# EAGLE design Motor (EAGLE 6.5.0)
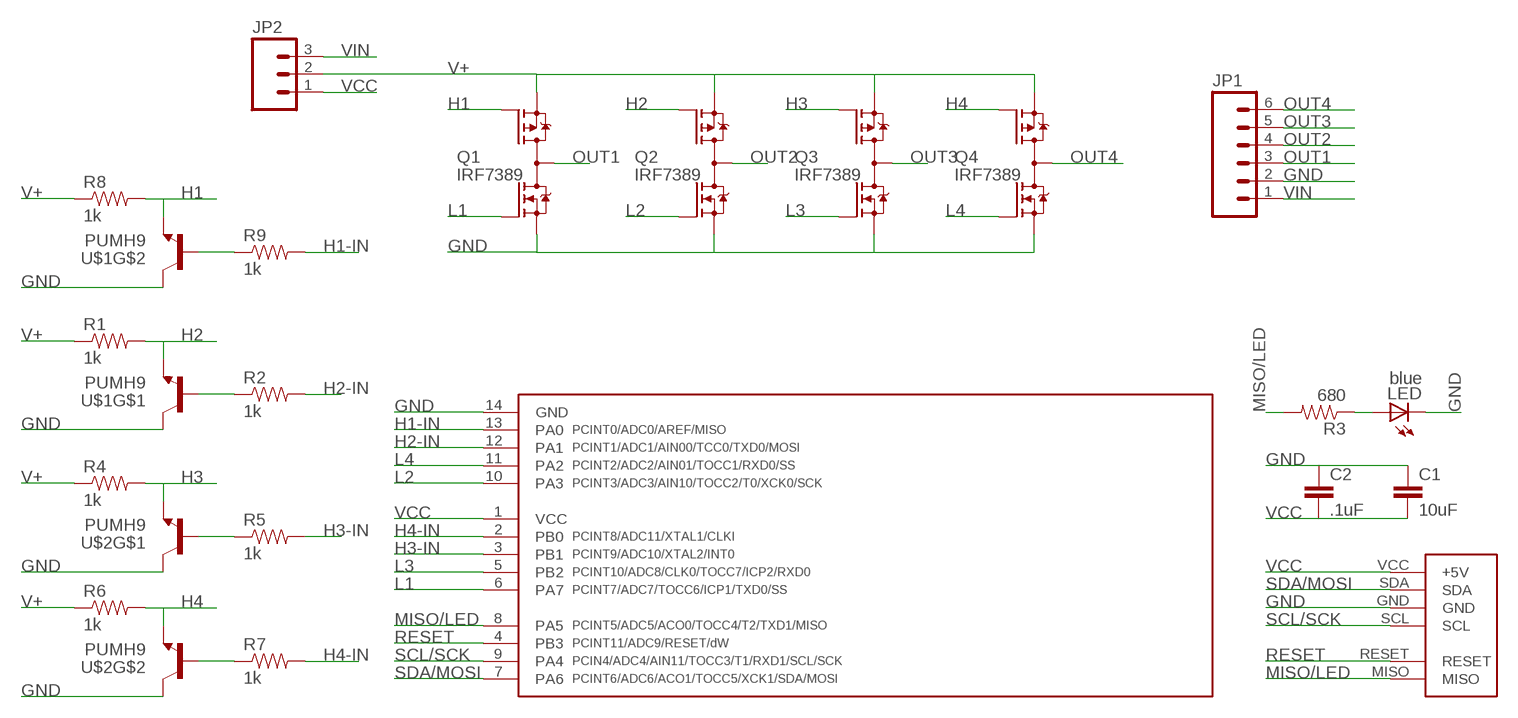
[diagram p0: schematic, sheet 1]

## Parts
C1  10uF  CAP0805  [0805]
C2  .1uF  CAP0805  [0805]
JP1  M063.5MM-6  [SCREWTERMINAL-3.5MM-6]
JP2  M03LOCK_NO_SILK  [1X03_LOCK_NO_SILK]
LED  blue  LEDCHIPLED_1206  [CHIPLED_1206]
Q1  IRF7389  [SO08-IRF]
Q2  IRF7389  [SO08-IRF]
Q3  IRF7389  [SO08-IRF]
Q4  IRF7389  [SO08-IRF]
R1  1k  RESISTOR0805-RES  [0805]
R2  1k  RESISTOR0805-RES  [0805]
R3  680  RESISTOR0805-RES  [0805]
R4  1k  RESISTOR0805-RES  [0805]
R5  1k  RESISTOR0805-RES  [0805]
R6  1k  RESISTOR0805-RES  [0805]
R7  1k  RESISTOR0805-RES  [0805]
R8  1k  RESISTOR0805-RES  [0805]
R9  1k  RESISTOR0805-RES  [0805]
U$1  PUMH9  MMDT3904  [SOT363]
U$2  PUMH9  MMDT3904  [SOT363]
U$3  TINY841  [SOIC14]
U$4  FOOTPRINTFOOTPRINT-2  [FOOTPRINT2]

## Nets
GND: C1.1 C2.1 JP1.2 LED.C Q1.1(N-S) Q2.1(N-S) Q3.1(N-S) Q4.1(N-S) U$1.3(C) U$1.6(C) U$2.3(C) U$2.6(C) U$3.14(GND) U$4.GND
H1: Q1.4(P-G) R8.2 U$1.1(E)
H1-IN: R9.2 U$3.13(PA0)
H2: Q2.4(P-G) R1.2 U$1.4(E)
H2-IN: R2.2 U$3.12(PA1)
H3: Q3.4(P-G) R4.2 U$2.4(E)
H3-IN: R5.2 U$3.3(PB1)
H4: Q4.4(P-G) R6.2 U$2.1(E)
H4-IN: R7.2 U$3.2(PB0)
L1: Q1.2(N-G) U$3.6(PA7)
L2: Q2.2(N-G) U$3.10(PA3)
L3: Q3.2(N-G) U$3.5(PB2)
L4: Q4.2(N-G) U$3.11(PA2)
MISO/LED: R3.2 U$3.8(PA5) U$4.MISO
N$2: R2.1 U$1.5(B)
N$4: R5.1 U$2.5(B)
N$5: LED.A R3.1
N$7: R7.1 U$2.2(B)
N$9: R9.1 U$1.2(B)
OUT1: JP1.3 Q1.5(D) Q1.6(D) Q1.7(D) Q1.8(D)
OUT2: JP1.4 Q2.5(D) Q2.6(D) Q2.7(D) Q2.8(D)
OUT3: JP1.5 Q3.5(D) Q3.6(D) Q3.7(D) Q3.8(D)
OUT4: JP1.6 Q4.5(D) Q4.6(D) Q4.7(D) Q4.8(D)
RESET: U$3.4(PB3) U$4.RESET
SCL/SCK: U$3.9(PA4) U$4.SCL
SDA/MOSI: U$3.7(PA6) U$4.SDA
V+: JP2.2 Q1.3(P-S) Q2.3(P-S) Q3.3(P-S) Q4.3(P-S) R1.1 R4.1 R6.1 R8.1
VCC: C1.2 C2.2 JP2.1 U$3.1(VCC) U$4.VCC(+5V)
VIN: JP1.1 JP2.3

## Library data of the parts
C1 C2 = SparkFun-Capacitors:CAP: Capacitor Standard 0603 ceramic capacitor, and 0.1" leaded capacitor.
JP1 = SparkFun-Connectors:M06: Header 6 Standard 6-pin 0.1" header. Use with straight break away headers (SKU : PRT-00116), right angle break away headers (PRT-00553), swiss pins (PRT-00743), machine pins (PRT-00117), and female headers (PRT-00115). Molex polarized connector foot print use with SKU : PRT-08094 with associated crimp pins and housings. NOTES ON THE VARIANTS LOCK and LOCK_LONGPADS... This footprint was designed to help hold the alignment of a through-hole component (i.e. 6-pin header) while soldering it into place. You may notice that each hole has been shifted either up or down by 0.005 of an inch from it's more standard position (which is a perfectly straight line). This slight alteration caused the pins (the squares in the middle) to touch the edges of the holes. Because they are alternating, it causes a "brace" to hold the component in place. 0.005 has proven to be the perfect amount of "off-center" position when using our standard breakaway headers. Although looks a little odd when you look at the bare footprint, once you have a header in there, the alteration is very hard to notice. Also,if you push a header all the way into place, it is covered up entirely on the bottom side. This idea of altering the position of holes to aid alignment will be further integrated into the Sparkfun Library for other footprints. It can help hold any component with 3 or more connection pins.
JP2 = SparkFun-Connectors:M03: Header 3 Standard 3-pin 0.1" header. Use with straight break away headers (SKU : PRT-00116), right angle break away headers (PRT-00553), swiss pins (PRT-00743), machine pins (PRT-00117), and female headers (PRT-00115). Molex polarized connector foot print use with SKU : PRT-08232 with associated crimp pins and housings.
LED = led:LED: LED OSRAM: - CHIPLED LG R971, LG N971, LY N971, LG Q971, LY Q971, LO R971, LY R971 LH N974, LH R974 LS Q976, LO Q976, LY Q976 LO Q996 - Hyper CHIPLED LW Q18S LB Q993, LB Q99A, LB R99A - SideLED LS A670, LO A670, LY A670, LG A670, LP A670 LB A673, LV A673, LT A673, LW A673 LH A674 LY A675 LS A676, LA A676, LO A676, LY A676, LW A676 LS A679, LY A679, LG A679 - Hyper Micro SIDELED® LS Y876, LA Y876, LO Y876, LY Y876 LT Y87S - SmartLED LW L88C, LW L88S LB L89C, LB L89S, LG L890 LS L89K, LO L89K, LY L89K LS L896, LA L896, LO L896, LY L896 - TOPLED LS T670, LO T670, LY T670, LG T670, LP T670 LSG T670, LSP T670, LSY T670, LOP T670, LYG T670 LG T671, LOG T671, LSG T671 LB T673, LV T673, LT T673, LW T673 LH T674 LS T676, LA T676, LO T676, LY T676, LB T676, LH T676, LSB T676, LW T676 LB T67C, LV T67C, LT T67C, LS T67K, LO T67K, LY T67K, LW E67C LS E67B, LA E67B, LO E67B, LY E67B, LB E67C, LV E67C, LT E67C LW T67C LS T679, LY T679, LG T679 LS T770, LO T770, LY T770, LG T770, LP T770 LB T773, LV T773, LT T773, LW T773 LH T774 LS E675, LA E675, LY E675, LS T675 LS T776, LA T776, LO T776, LY T776, LB T776 LHGB T686 LT T68C, LB T68C - Hyper Mini TOPLED® LB M676 - Mini TOPLED Santana® LG M470 LS M47K, LO M47K, LY M47K Source: http://www.osram.convergy.de LUXEON: - LUMILED® LXK2-PW12-R00, LXK2-PW12-S00, LXK2-PW14-U00, LXK2-PW14-V00 LXK2-PM12-R00, LXK2-PM12-S00, LXK2-PM14-U00 LXK2-PE12-Q00, LXK2-PE12-R00, LXK2-PE12-S00, LXK2-PE14-T00, LXK2-PE14-U00 LXK2-PB12-K00, LXK2-PB12-L00, LXK2-PB12-M00, LXK2-PB14-N00, LXK2-PB14-P00, LXK2-PB14-Q00 LXK2-PR12-L00, LXK2-PR12-M00, LXK2-PR14-Q00, LXK2-PR14-R00 LXK2-PD12-Q00, LXK2-PD12-R00, LXK2-PD12-S00 LXK2-PH12-R00, LXK2-PH12-S00 LXK2-PL12-P00, LXK2-PL12-Q00, LXK2-PL12-R00 Source: www.luxeon.com KINGBRIGHT: KA-3528ASYC Source: www.kingbright.com
Q1-Q4 = transistor-fet:IRF7389: Complimentary Half Bridge HEXFET Power MOSFET Source: http://www.irf.com/product-info/datasheets/data/irf7389.pdf
R1 R2 R4-R9 = SparkFun-Resistors:RESISTOR: Resistor Basic schematic elements and footprints for 0603, 1206, and PTH resistors.
R3 = SparkFun-Passives:RESISTOR: Resistor Basic schematic elements and footprints for 0603, 1206, and PTH resistors.
U$1 U$2 = SparkFun-DiscreteSemi:MMDT3904: Dual NPN transistor
U$3 = IntegerLabs:TINY841
U$4 = IntegerLabs:FOOTPRINT

## Board
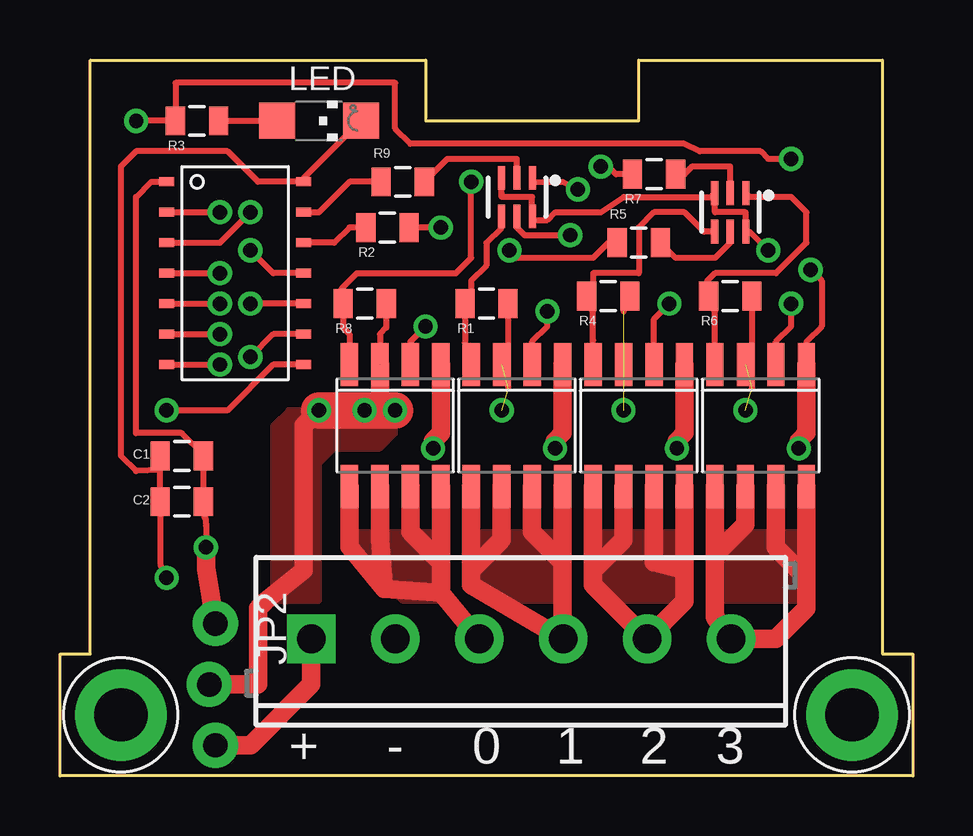
[diagram p1: board, top side]
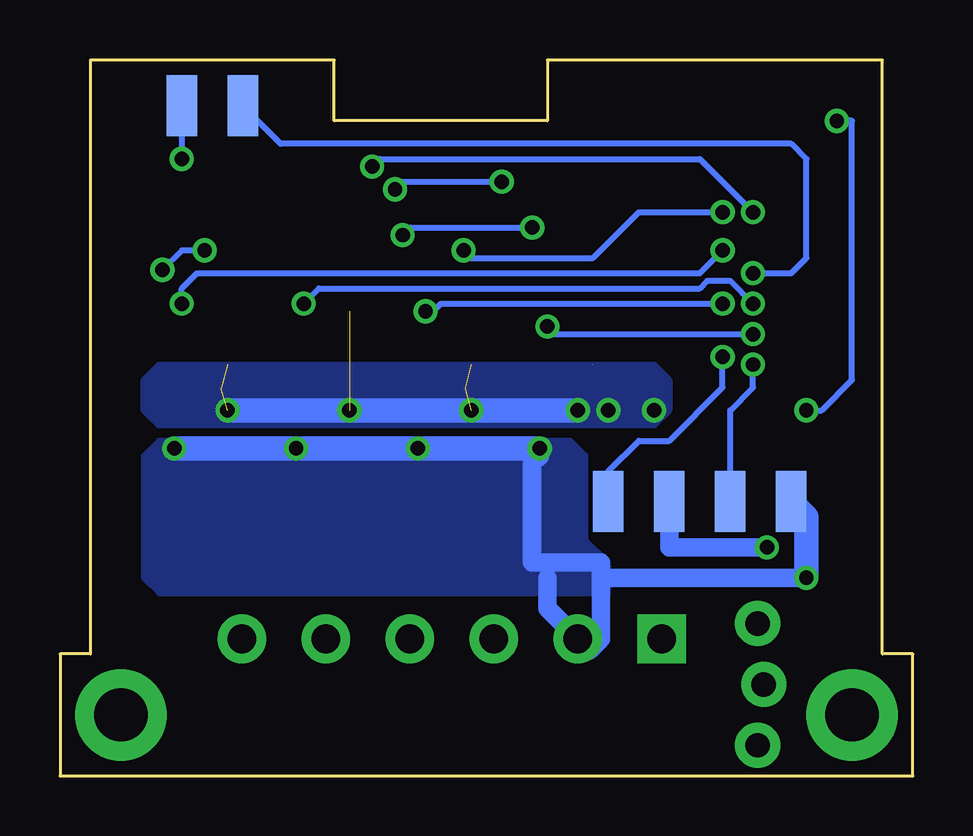
[diagram p2: board, bottom side, seen from below]

Size 35.56 x 29.84 mm. Coordinates in mm from the lower left corner, seen from the top.
Copper layers (1*16): Top 0.0178mm / dielectric 59mil / Bottom 0.0178mm
Design rules "SSC-EAGLE-2Lyr_v1.0.0.3": minimum track width 6mil, minimum drill 14mil, track to track 6mil, track to pad 6mil, pad to pad 6mil, via to via 6mil, smd to smd 6mil, copper to edge 20mil, drill to drill 16mil, minimum pad ring 8mil, minimum via ring 8mil, stop-mask expansion 3mil, vias tented up to drill 0mil, thermal gap 10mil

### Footprints (pad centres in the part's own frame; a part is rotated, then mirrored left to right if it is on the bottom)
0805 = smd 0.8 x 1.2: 1 -0.9,0; 2 0.9,0
SCREWTERMINAL-3.5MM-6 = drill 1.2 pad 2.032 square: 1 0,0 | drill 1.2 pad 2.032: 2 3.5,0; 3 7,0; 4 10.5,0; 5 14,0; 6 17.5,0
1X03_LOCK_NO_SILK = drill 1.016 pad 1.88: 1 0,0.127; 2 2.54,-0.127; 3 5.08,0.127
CHIPLED_1206 = smd 1.5 x 1.5: A 0,-1.75; C 0,1.75
SO08-IRF = smd 0.72 x 1.78: 1 -1.905,-2.543; 2 -0.635,-2.543; 3 0.635,-2.543; 4 1.905,-2.543; 5 1.905,2.543; 6 0.635,2.543; 7 -0.635,2.543; 8 -1.905,2.543
SOT363 = smd 0.3 x 0.99: 1 -0.65,-0.8; 2 0,-0.8; 3 0.65,-0.8; 4 0.65,0.81; 5 0,0.81; 6 -0.65,0.81
SOIC14 = smd 0.381 x 0.635: 1 0,-3.175; 2 1.27,-3.175; 3 2.54,-3.175; 4 3.81,-3.175; 5 5.08,-3.175; 6 6.35,-3.175; 7 7.62,-3.175; 8 7.62,2.54; 9 6.35,2.54; 10 5.08,2.54; 11 3.81,2.54; 12 2.54,2.54; 13 1.27,2.54; 14 0,2.54
FOOTPRINT2 = smd 1.27 x 2.54 bottom: GND 5.08,11.43; MISO 30.48,27.94; RESET 27.94,27.94; SCL 12.7,11.43; SDA 7.62,11.43; VCC 10.16,11.43 | drill 2.223 pad 3.81: P$1 2.54,2.54; P$2 33.02,2.54

### Placement (x,y rotation side)
C1  5.08,13.34 0 top
C2  5.08,11.43 0 top
JP1  10.48,5.71 0 top
JP2  6.35,6.35 270 top
LED  10.79,27.3 270 top
Q1  13.97,14.61 180 top
Q2  19.05,14.61 180 top
Q3  24.13,14.61 180 top
Q4  29.21,14.61 180 top
R1  17.78,19.68 180 top
R2  13.65,22.86 180 top
R3  5.71,27.3 180 top
R4  22.86,20 180 top
R5  24.13,22.23 180 top
R6  27.94,20 180 top
R7  24.77,25.08 180 top
R8  12.7,19.68 180 top
R9  14.29,24.77 180 top
U$1  19.05,24.13 180 top
U$2  27.94,23.5 180 top
U$3  7.62,24.77 270 top
U$4  0,0 0 top

### Tracks (layer width: path | path; a pad name or v marks a point on that pad's centre or on a via)
GND  (via drill 0.6)
  Top 0.254: v4.45,8.26 4.18,8.84 C2.1 C1.1 4.18,12.75 3.17,12.7 2.54,13.34 2.54,25.4 3.17,26.04 6.98,26.04 8.25,24.77 U$3.14 10.16,24.92 LED.C | v31.29,21.1 31.75,20.64 31.75,18.73 31.12,18.1 Q4.1 | U$1.3 18.41,24.28 18.41,24.13 19.68,24.13 19.7,23.48 U$1.6 19.68,23.3 19.68,23.18 20.32,23.18 20.64,23.5 22.54,23.5 23.49,24.13 27.12,24.13 U$2.3 27.3,24.28 27.3,23.5 28.58,23.5 28.59,23.48 U$2.6 28.75,22.68 v29.53,21.91
  Top 0.762: Q4.1 31.12,14.29 30.8,13.97 v30.8,13.65 | Q3.1 26.03,14.29 25.72,13.97 v25.72,13.65 | Q2.1 20.95,14.29 20.64,13.97 v20.64,13.65 | Q1.1 15.88,14.29 15.56,13.97 v15.56,13.65
  Bottom 0.254: v29.53,21.91 30.48,21.91 v31.29,21.1
  Bottom 0.762: v15.56,13.65 15.56,13.34 15.88,13.02 15.88,8.89 13.02,8.89 13.02,8.26 | 13.02,8.26 13.02,5.71 13.5,5.24 JP1.2 | JP1.2 15.24,6.99 15.24,8.26 | v4.45,8.26 13.02,8.26
  Bottom 1.016: v30.8,13.65 v25.72,13.65 v20.64,13.65 v15.56,13.65 | v4.45,8.26 4.45,10.79 U$4.GND
  pour Bottom: 31.43,7.62 12.7,7.62 12.7,8.89 13.65,9.84 13.65,13.34 14.29,13.97 31.43,13.97 32.07,13.34 32.07,8.26
H1  (via drill 0.6)
  Top 0.254: Q1.4 12.06,18.41 11.8,18.68 11.8,19.32 R8.2 11.75,20 11.75,20.32 12.38,20.95 16.51,20.95 17.14,21.59 v17.14,24.77 | U$1.1 19.7,24.75 20.95,24.77 v21.59,24.45
  Bottom 0.254: v21.59,24.45 21.59,24.77 v17.14,24.77
H1-IN
  Top 0.254: R9.2 12.06,24.77 10.79,23.5 U$3.13
H2
  Top 0.254: Q2.4 16.88,18.05 R1.2 17.14,20.27 17.14,20.64 17.78,21.27 17.78,22.23 18.4,22.84 U$1.4
H2-IN
  Top 0.254: R2.2 12.06,22.86 11.43,22.23 U$3.12
H3
  Top 0.254: U$2.4 26.84,22.68 26.03,23.5 24.77,23.5 24.13,22.86 24.13,20.95 22.22,20.95 22.22,20.59 R4.2 21.91,19.68 22.22,19.37 22.22,18.15 Q3.4
H3-IN  (via drill 0.6)
  Top 0.254: R5.2 22.86,22.23 22.22,21.59 19.05,21.59 v18.73,21.91 | U$3.3 6.67,22.23 v7.94,23.5
  Bottom 0.254: v18.73,21.91 18.73,21.59 13.34,21.59 11.43,23.5 v7.94,23.5
H4
  Top 0.254: U$2.1 28.76,24.13 30.48,24.13 31.12,23.5 31.12,22.23 29.84,20.95 27.3,20.95 26.99,20.64 26.99,20.05 R6.2 26.99,19.68 27.3,19.37 Q4.4
H4-IN  (via drill 0.6)
  Top 0.254: R7.2 23.18,25.08 22.86,25.4 v22.54,25.4 | U$3.2 v6.67,23.5
  Bottom 0.254: v22.54,25.4 22.22,25.72 8.89,25.72 v6.67,23.5
L1  (via drill 0.6)
  Top 0.254: Q1.2 14.61,18.1 v15.24,18.73 | U$3.6 v6.67,18.41
  Bottom 0.254: v15.24,18.73 14.92,18.41 v6.67,18.41
L2  (via drill 0.6)
  Top 0.254: Q2.2 19.68,18.1 20.32,18.73 v20.32,19.37 | U$3.10 v7.94,19.68
  Bottom 0.254: v20.32,19.37 20.32,19.05 19.68,19.68 v7.94,19.68
L3  (via drill 0.6)
  Top 0.254: Q3.2 24.77,19.05 v25.4,19.68 | U$3.5 v6.67,19.68
  Bottom 0.254: v25.4,19.68 24.77,20.32 8.89,20.32 8.57,20.64 7.62,20.64 v6.67,19.68
L4  (via drill 0.6)
  Top 0.254: Q4.2 29.84,18.1 30.48,18.73 v30.48,19.68 | U$3.11 8.89,20.95 v7.94,21.91
  Bottom 0.254: v30.48,19.68 30.48,20.32 29.84,20.95 8.89,20.95 v7.94,21.91
MISO/LED  (via drill 0.6)
  Top 0.254: v30.48,25.72 29.53,25.72 29.21,26.04 26.67,26.04 26.03,26.35 14.61,26.35 13.97,26.99 13.97,28.89 4.81,28.89 R3.2 v3.17,27.3 | U$3.8 8.89,17.14 6.98,15.24 v4.45,15.24
  Bottom 0.254: U$4.MISO v30.48,25.72 | v4.45,15.24 3.81,15.24 2.54,16.51 2.54,27.3 v3.17,27.3
N$2  (via drill 0.6)
  Top 0.254: U$1.5 19.05,22.86 19.37,22.54 v21.27,22.54 | v15.88,22.86 14.61,22.86 14.61,23.23 R2.1
  Bottom 0.254: v21.27,22.54 20.95,22.86 v15.88,22.86
N$4
  Top 0.254: U$2.5 27.94,22.23 27.3,21.59 25.66,21.59 R5.1
N$5
  Top 0.254: R3.1 LED.A
N$7
  Top 0.254: U$2.2 27.94,25.4 26.35,25.4 26.03,25.08 R7.1
N$9
  Top 0.254: U$1.2 19.05,25.72 16.14,25.72 R9.1
OUT1
  Top 0.762: Q1.8 15.88,8.89 | 13.5,7.79 12.06,9.54 Q1.5 | 13.5,7.79 15.88,7.63 | 15.88,7.63 JP1.3 | Q1.6 13.34,9.84 13.5,7.79 | Q1.7 14.61,10.16 15.88,8.89 | 15.88,7.63 15.89,7.63 15.88,7.62 15.88,7.63 | 15.88,7.63 15.88,8.89
  pour Top: 12.06,10.16 15.88,10.16 15.88,7.3 14.29,7.3 12.06,9.53
OUT2
  Top 0.762: 20.95,5.69 JP1.4 | Q2.5 17.14,8.57 | 17.14,8.57 17.14,7.96 JP1.4 | Q2.8 20.95,8.89 | 20.95,8.89 20.95,7.28 JP1.4 | Q2.7 19.68,10.16 20.95,8.89 | Q2.6 18.41,9.84 17.14,8.57
  pour Top: 17.14,10.16 20.95,10.16 20.95,7.3 17.78,7.3 17.14,7.94
OUT3
  Top 0.762: Q3.5 22.22,8.57 | 22.22,8.57 22.22,7.97 JP1.5 26.03,7.27 26.03,8.57 | Q3.8 26.03,8.57 | Q3.7 24.77,8.89 26.03,8.57 | Q3.6 23.49,9.84 22.22,8.57
  pour Top: 22.22,10.16 26.03,10.16 26.03,7.3 22.54,7.3
OUT4
  Top 0.762: Q4.8 31.12,8.26 | 31.12,8.26 31.12,6.99 29.84,5.71 JP1.6 27.3,6.63 27.3,9.21 | Q4.5 27.3,9.21 | Q4.7 29.84,9.53 31.12,8.26 | Q4.6 28.58,10.48 27.3,9.21
  pour Top: 27.3,10.16 30.8,10.16 31.12,7.3 27.3,7.3
RESET  (via drill 0.6)
  Top 0.254: U$3.4 v6.67,20.95
  Bottom 0.254: v6.67,20.95 5.08,20.95 4.45,21.59 4.45,25.72 5.08,26.35 26.35,26.35 U$4.RESET
SCL/SCK  (via drill 0.6)
  Top 0.254: U$3.9 8.89,18.41 v7.94,17.46
  Bottom 0.254: U$4.SCL 12.7,12.7 11.43,13.97 10.16,13.97 7.94,16.19 v7.94,17.46
SDA/MOSI  (via drill 0.6)
  Top 0.254: U$3.7 v6.67,17.14
  Bottom 0.254: U$4.SDA 7.62,15.24 6.67,16.19 v6.67,17.14
V+  (via drill 0.6)  (7 unrouted)
  Top 0.254: 23.49,19.37 23.81,19.68 R4.1 | R6.1 28.84,16.14 | R1.1 18.68,16.14 | R8.1 13.6,18.68 13.34,18.41 Q1.3 13.28,16.78
  Top 0.762: Q1.3 13.34,15.24 v13.97,15.24 | 10.48,15.24 v10.79,15.24 10.16,14.61 10.16,8.57 8.57,7.3 8.25,6.99 8.25,3.81 JP2.2
  Top 1.524: v10.79,15.24 v12.7,15.24 v13.97,15.24
  Bottom 1.016: v13.97,15.24 v18.41,15.24 v23.49,15.24 v28.58,15.24
  pour Bottom: 10.16,16.51 10.16,15.24 10.79,14.61 31.43,14.61 32.07,15.24 32.07,16.51 31.43,17.14 10.79,17.14
  pour Top: 8.89,7.3 10.79,7.3 10.79,13.02 11.43,13.65 13.34,13.65 13.97,14.29 13.97,15.24 9.52,15.24 8.89,14.61
VCC  (via drill 0.6)
  Top 0.254: C2.2 6.08,10.43 v6.08,9.53 | C2.2 C1.2 5.98,13.39 5.08,14.29 3.17,14.29 3.17,24.13 3.81,24.77 U$3.1 | 6.03,10.74 C2.2
  Top 0.762: v6.08,9.53 6.08,8.65 JP2.1
  Bottom 0.762: U$4.VCC 10.16,9.53 v6.08,9.53
VIN
  Top 0.762: JP1.1 10.48,3.81 7.94,1.27 JP2.3

### Text on the board
tPlace: + | - | 0 | 1 | 2 | 3